# EAGLE design rca_studio_II_single_v3 (EAGLE 8.3.2)
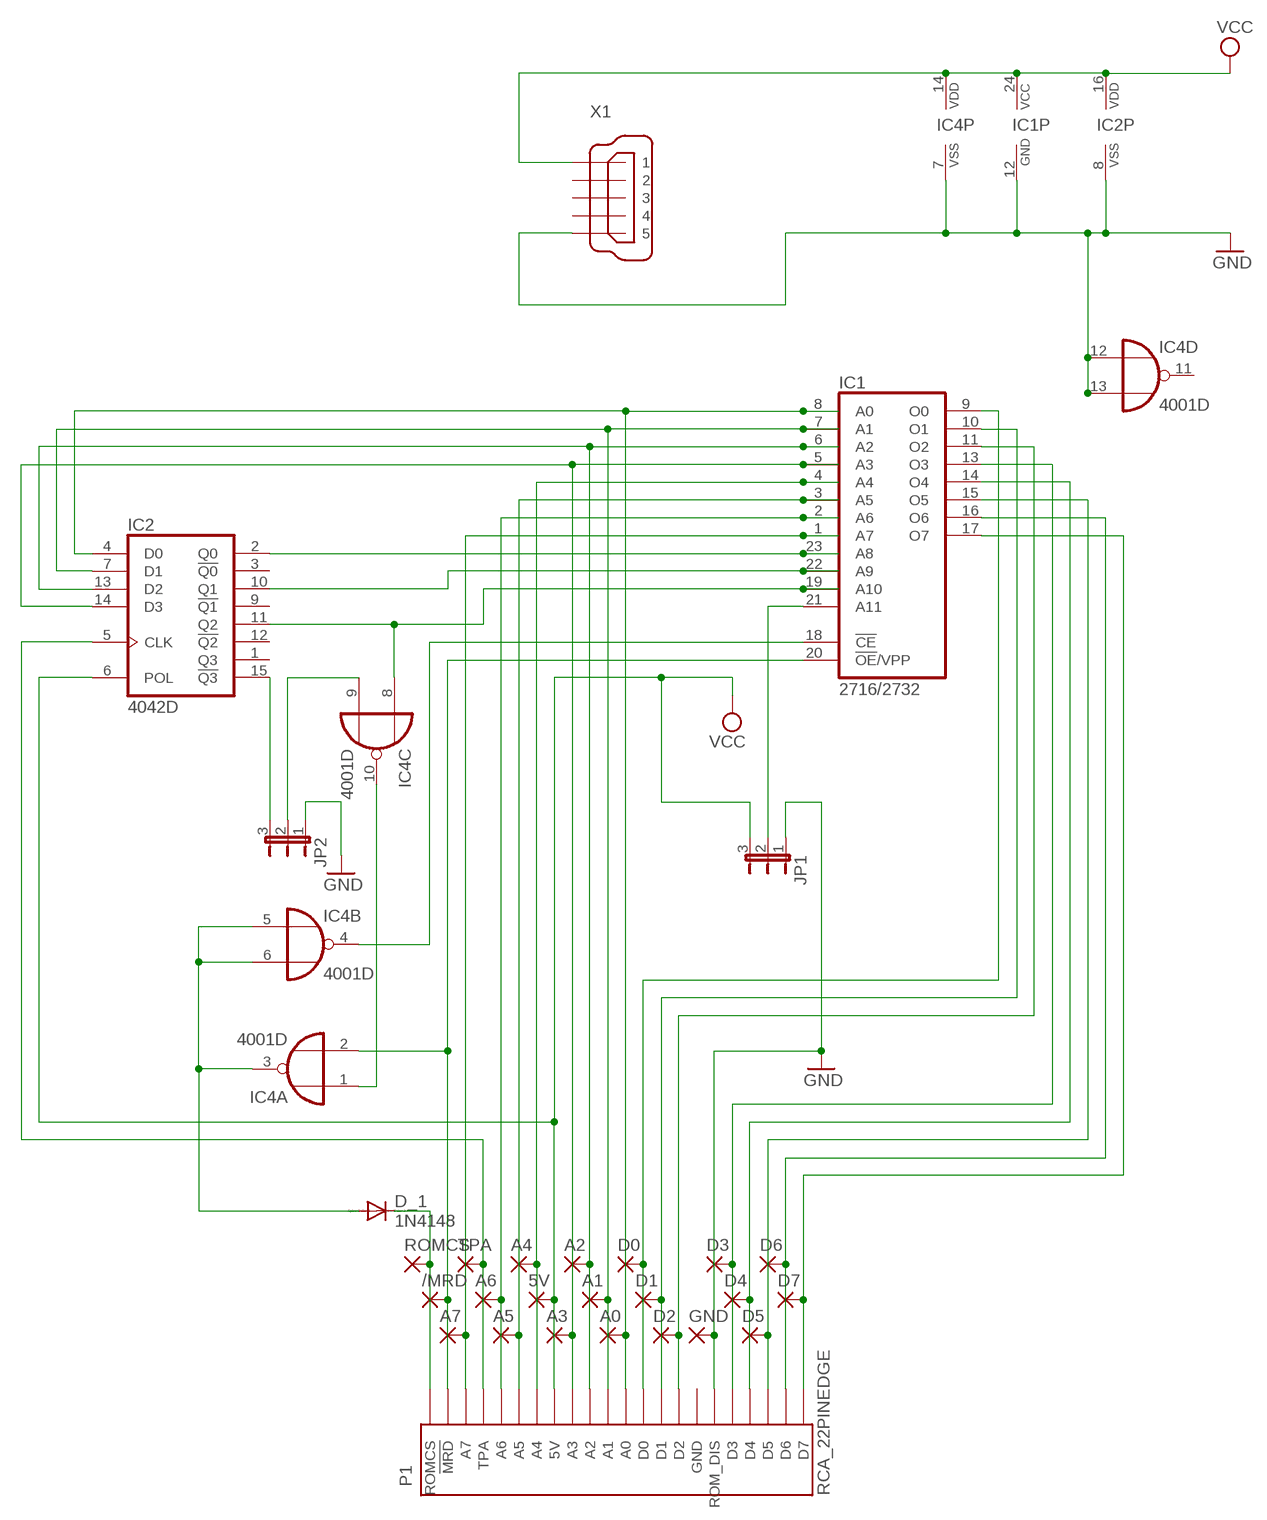
[diagram p0: schematic, sheet 1]

## Parts
5V  WIREPAD2,15/1,0  [2,15/1,0]
/MRD  WIREPAD2,15/1,0  [2,15/1,0]
A0  WIREPAD2,15/1,0  [2,15/1,0]
A1  WIREPAD2,15/1,0  [2,15/1,0]
A2  WIREPAD2,15/1,0  [2,15/1,0]
A3  WIREPAD2,15/1,0  [2,15/1,0]
A4  WIREPAD2,15/1,0  [2,15/1,0]
A5  WIREPAD2,15/1,0  [2,15/1,0]
A6  WIREPAD2,15/1,0  [2,15/1,0]
A7  WIREPAD2,15/1,0  [2,15/1,0]
D0  WIREPAD2,15/1,0  [2,15/1,0]
D1  WIREPAD2,15/1,0  [2,15/1,0]
D2  WIREPAD2,15/1,0  [2,15/1,0]
D3  WIREPAD2,15/1,0  [2,15/1,0]
D4  WIREPAD2,15/1,0  [2,15/1,0]
D5  WIREPAD2,15/1,0  [2,15/1,0]
D6  WIREPAD2,15/1,0  [2,15/1,0]
D7  WIREPAD2,15/1,0  [2,15/1,0]
D_1  1N4148  1N4148DO35-7  [DO35-7]
GND  WIREPAD2,15/1,0  [2,15/1,0]
IC1  2716/2732  2732  [DIL24]
IC2  4042D  [SO16]
IC4  4001D  [SO14]
JP1  JP2E  [JP2]
JP2  JP2E  [JP2]
P1  RCA_22PINEDGE  [RCA_22PINEDGE]
ROMCS  WIREPAD2,15/1,0  [2,15/1,0]
TPA  WIREPAD2,15/1,0  [2,15/1,0]
X1  MINI-USB-32005-301  [32005-301]

## Nets
01: D1.1(P) IC1.10(O1) P1.9(D1)
/MRD: /MRD.1(P) IC1.20(!OE!/VPP) IC4.2(A:I1) P1.21(!MRD)
A0: A0.1(P) IC1.8(A0) IC2.4(D0) P1.11(A0)
A1: A1.1(P) IC1.7(A1) IC2.7(D1) P1.12(A1)
A2: A2.1(P) IC1.6(A2) IC2.13(D2) P1.13(A2)
A3: A3.1(P) IC1.5(A3) IC2.14(D3) P1.14(A3)
A4: A4.1(P) IC1.4(A4) P1.16(A4)
A5: A5.1(P) IC1.3(A5) P1.17(A5)
A6: A6.1(P) IC1.2(A6) P1.18(A6)
A7: A7.1(P) IC1.1(A7) P1.20(A7)
A8: IC1.23(A8) IC2.2(Q0)
A9: IC1.22(A9) IC2.10(Q1)
A10: IC1.19(A10) IC2.11(Q2) IC4.8(C:I0)
A11: IC1.21(A11) JP1.2
D0: D0.1(P) IC1.9(O0) P1.10(D0)
D2: D2.1(P) IC1.11(O2) P1.8(D2)
D3: D3.1(P) IC1.13(O3) P1.5(D3)
D4: D4.1(P) IC1.14(O4) P1.4(D4)
D5: D5.1(P) IC1.15(O5) P1.3(D5)
D6: D6.1(P) IC1.16(O6) P1.2(D6)
D7: D7.1(P) IC1.17(O7) P1.1(D7)
GND: GND.1(P) IC1.12(GND) IC2.8(VSS) IC4.7(P:VSS) IC4.12(D:I0) IC4.13(D:I1) JP1.1 JP2.1 P1.6(ROM_DIS) X1.5
N$1: IC4.1(A:I0) IC4.10(C:O)
N$2: IC4.9(C:I1) JP2.2
N$3: IC1.18(!CE) IC4.4(B:O)
N$21: D_1.A IC4.3(A:O) IC4.5(B:I0) IC4.6(B:I1)
N$23: IC2.15(!Q3) JP2.3
ROMCS: D_1.C P1.22(ROMCS) ROMCS.1(P)
TPA: IC2.5(CLK) P1.19(TPA) TPA.1(P)
VCC: 5V.1(P) IC1.24(VCC) IC2.6(POL) IC2.16(VDD) IC4.14(P:VDD) JP1.3 P1.15(5V) X1.1
Unconnected: IC2.1(Q3) IC2.3(!Q0) IC2.9(!Q1) IC2.12(!Q2) IC4.11(D:O) P1.7(GND) X1.2 X1.3 X1.4

## Library data of the parts
5V /MRD A0 A1-A7 D0 D1-D7 GND ROMCS TPA = wirepad:WIREPAD: Wire PAD connect wire on PCB
D_1 = diode:1N4148: DIODE high speed (Philips)
IC1 = memory:2732: MEMORY
IC2 = 40xx:4042: Quad clocked D LATCH
IC4 = 40xx:4001: Quad 2-input NOR
JP1 JP2 = jumper:JP2E: JUMPER
P1 = mylib:RCA_22PINEDGE: 22 PIN EDGE CONNECTOR FOR PCB
X1 = con-cypressindustries:MINI-USB-: MINI USB-B Conector Source: www.cypressindustries.com; OC_FARNELL: unknown; OC_NEWARK: unknown

## Board
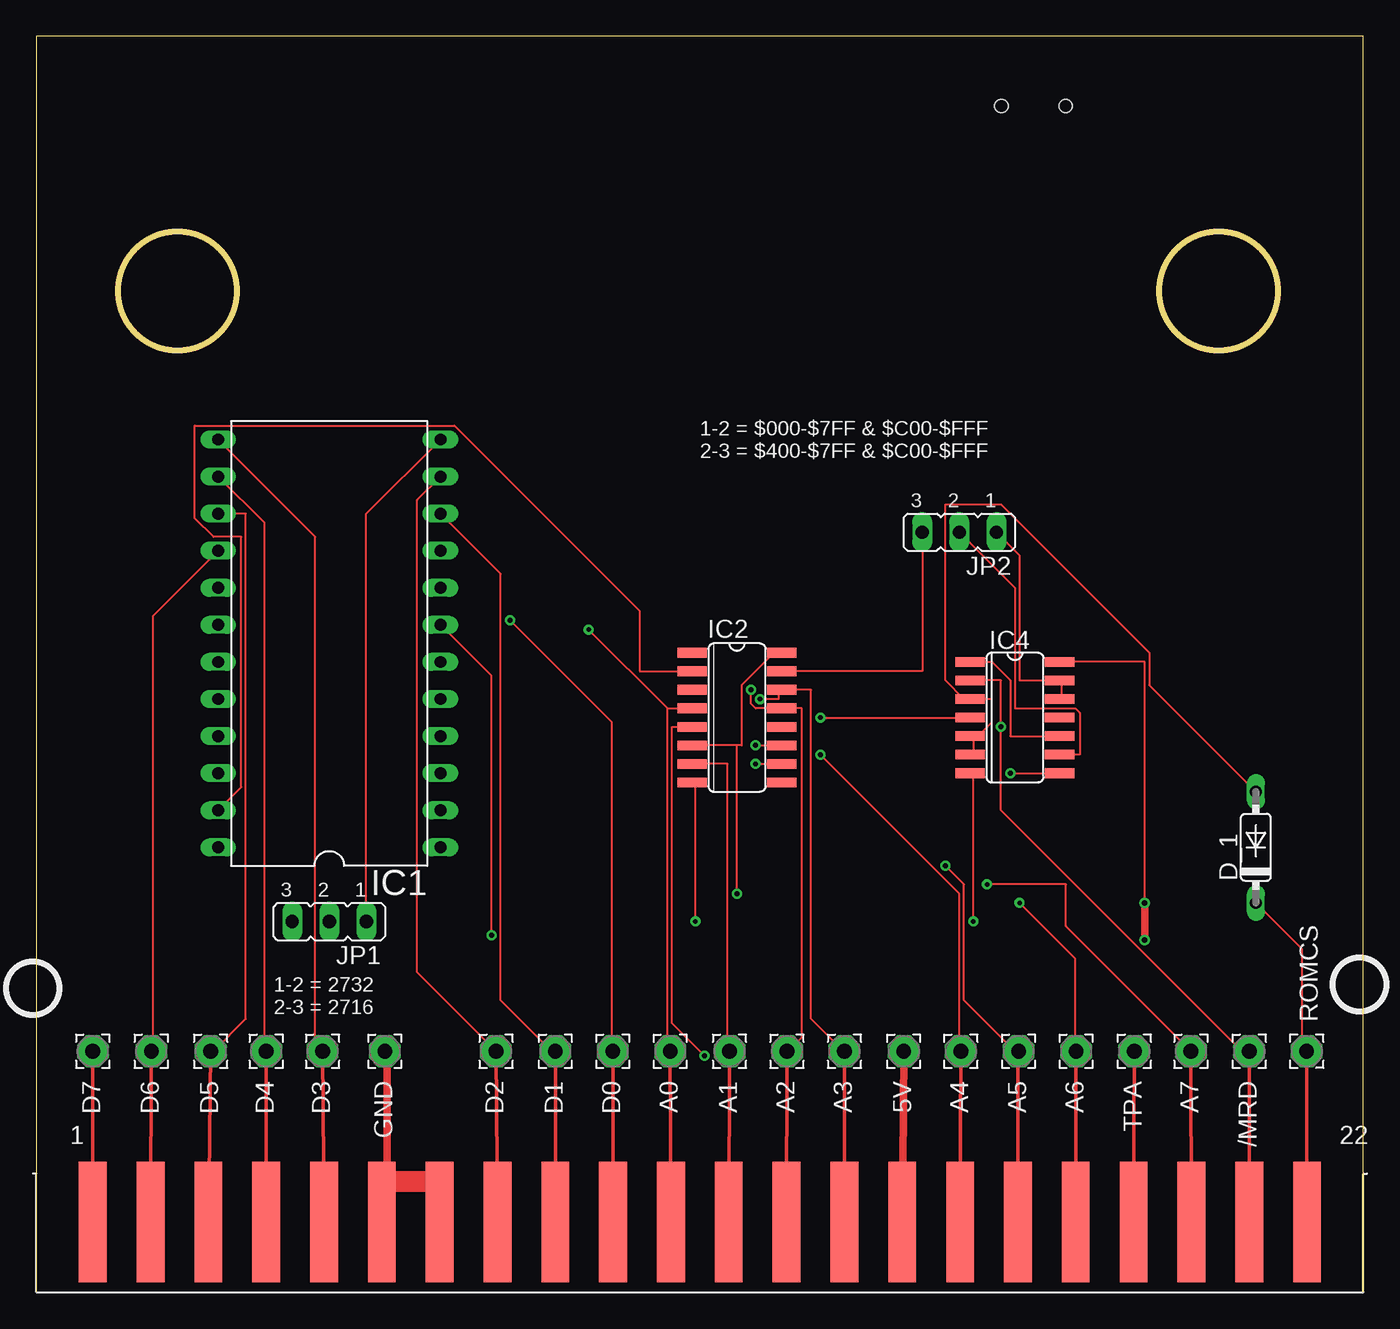
[diagram p1: board, top side]
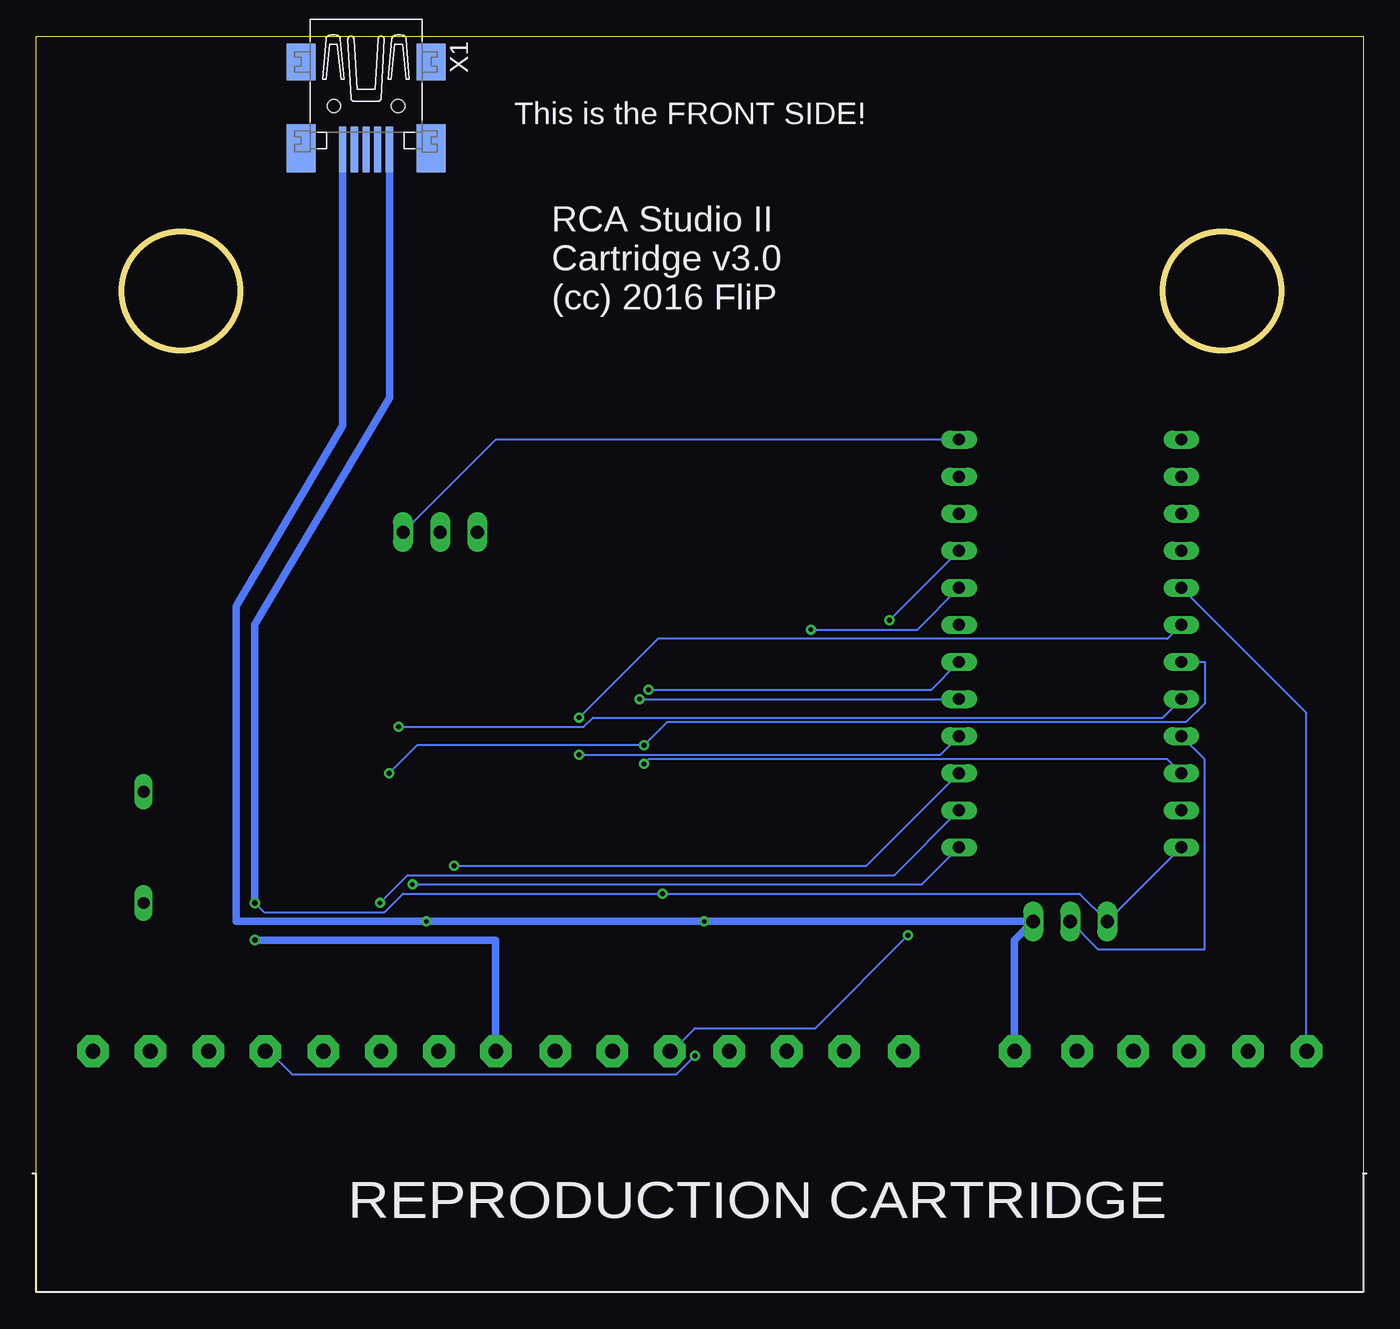
[diagram p2: board, bottom side, seen from below]

Size 90.91 x 86.03 mm. Coordinates in mm from the lower left corner, seen from the top.
Outline: 90.91,0 90.91,86.03 0,86.03 0,0
Outline: circle at 81.03,68.58 radius 4.06
Outline: circle at 9.65,68.58 radius 4.06
Copper layers (1*16): Top 0.0356mm / dielectric 1.5011mm / Bottom 0.0356mm
Design rules "oshpark-2layer": minimum track width 6mil, minimum drill 13mil, track to track 6mil, track to pad 6mil, pad to pad 6mil, via to via 6mil, smd to smd 6mil, copper to edge 15mil, drill to drill 6mil, minimum pad ring 7mil, minimum via ring 7mil, stop-mask expansion 2.5mil, vias tented up to drill 0mil, thermal gap 10mil

### Footprints (pad centres in the part's own frame; a part is rotated, then mirrored left to right if it is on the bottom)
2,15/1,0 = drill 1.016 pad 2.159 octagon: 1 0,0
DO35-7 = drill 0.813 long: A 3.81,0; C -3.81,0
DIL24 = drill 0.813 long: 1 -13.97,-7.62; 2 -11.43,-7.62; 3 -8.89,-7.62; 4 -6.35,-7.62; 5 -3.81,-7.62; 6 -1.27,-7.62; 7 1.27,-7.62; 8 3.81,-7.62; 9 6.35,-7.62; 10 8.89,-7.62; 11 11.43,-7.62; 12 13.97,-7.62; 13 13.97,7.62; 14 11.43,7.62; 15 8.89,7.62; 16 6.35,7.62; 17 3.81,7.62; 18 1.27,7.62; 19 -1.27,7.62; 20 -3.81,7.62; 21 -6.35,7.62; 22 -8.89,7.62; 23 -11.43,7.62; 24 -13.97,7.62
SO16 = smd 0.66 x 2.032: 1 -4.445,-3.073; 2 -3.175,-3.073; 3 -1.905,-3.073; 4 -0.635,-3.073; 5 0.635,-3.073; 6 1.905,-3.073; 7 3.175,-3.073; 8 4.445,-3.073; 9 4.445,3.073; 10 3.175,3.073; 11 1.905,3.073; 12 0.635,3.073; 13 -0.635,3.073; 14 -1.905,3.073; 15 -3.175,3.073; 16 -4.445,3.073
SO14 = smd 0.66 x 2.032: 1 -3.81,-3.073; 2 -2.54,-3.073; 3 -1.27,-3.073; 4 0,-3.073; 5 1.27,-3.073; 6 2.54,-3.073; 7 3.81,-3.073; 8 3.81,3.073; 9 2.54,3.073; 10 1.27,3.073; 11 0,3.073; 12 -1.27,3.073; 13 -2.54,3.073; 14 -3.81,3.073
JP2 = drill 0.914 long: 1 -2.54,0; 2 0,0; 3 2.54,0
RCA_22PINEDGE = smd 1.905 x 8.255: 1 -41.605,4.826; 2 -37.643,4.826; 3 -33.68,4.826; 4 -29.718,4.826; 5 -25.756,4.826; 6 -21.793,4.826; 7 -17.831,4.826; 8 -13.868,4.826; 9 -9.906,4.826; 10 -5.944,4.826; 11 -1.981,4.826; 12 1.981,4.826; 13 5.944,4.826; 14 9.906,4.826; 15 13.868,4.826; 16 17.831,4.826; 17 21.793,4.826; 18 25.756,4.826; 19 29.718,4.826; 20 33.68,4.826; 21 37.643,4.826; 22 41.605,4.826
32005-301 = smd 3.1 x 0.5: 1 3,1.6; 2 3,0.8; 3 3,0; 4 3,-0.8; 5 3,-1.6 | smd 2.5 x 2: M1 -3,-4.45; M2 -3,4.45 | smd 3.3 x 2: M3 2.9,4.45; M4 2.9,-4.45 | hole 0.9: 0,2.2; 0,-2.2

### Placement (x,y rotation side)
5V  59.44,16.51 180 top
/MRD  83.11,16.51 180 top
A0  43.43,16.51 180 top
A1  47.5,16.51 180 top
A2  51.44,16.51 180 top
A3  55.37,16.51 180 top
A4  63.35,16.51 180 top
A5  67.31,16.51 180 top
A6  71.25,16.51 180 top
A7  79.12,16.51 180 top
D0  39.5,16.51 180 top
D1  35.56,16.51 180 top
D2  31.5,16.51 180 top
D3  19.61,16.51 180 top
D4  15.75,16.51 180 top
D5  11.94,16.51 180 top
D6  7.87,16.51 180 top
D7  3.86,16.51 180 top
D_1  83.57,30.48 90 top
GND  23.88,16.51 180 top
IC1  20.07,44.45 90 top
IC2  48.01,39.37 270 top
IC4  67.06,39.37 270 top
JP1  20.07,25.4 180 top
JP2  63.25,52.07 180 top
P1  45.47,0 0 top
ROMCS  87.05,16.51 0 top
TPA  75.23,16.51 180 top
X1  68.33,81.28 270 bottom

### Tracks (layer width: path | path; a pad name or v marks a point on that pad's centre or on a via)
01
  Top 0.152: IC1.10 31.81,49.21 31.81,20 35.31,16.51 D1.1
  Top 0.254: P1.9 D1.1
/MRD  (via drill 0.33)
  Top 0.152: IC4.2 66.1,41.91 v66.1,38.73 66.1,33.02 82.61,16.51 /MRD.1
  Top 0.254: P1.21 /MRD.1
  Bottom 0.152: IC1.20 13.72,39.37 52.77,39.37 53.4,38.73 v66.1,38.73
A0  (via drill 0.33)
  Top 0.152: 43.24,40.01 IC2.4 | 43.24,40.01 43.24,16.51 A0.1 | 43.24,40.01 v37.85,45.4
  Top 0.254: P1.11 A0.1
  Bottom 0.152: IC1.8 30.54,45.4 v37.85,45.4
A1  (via drill 0.33)
  Top 0.152: IC2.7 47.37,36.2 47.37,16.51 A1.1 | IC1.7 31.18,42.23 v31.18,24.45
  Top 0.254: P1.12 A1.1
  Bottom 0.152: v31.18,24.45 37.53,18.1 45.78,18.1 47.37,16.51 A1.1
A2  (via drill 0.33)
  Top 0.152: A2.1 51.5,16.51 52.45,17.46 52.45,40.01 IC2.13 49.28,40.01 48.96,40.32 v48.96,41.27
  Top 0.254: P1.13 A2.1
  Bottom 0.152: IC1.6 29.59,41.27 v48.96,41.27
A3  (via drill 0.33)
  Top 0.152: A3.1 55.31,16.51 53.09,18.73 53.09,41.27 IC2.14 50.86,41.27 50.86,40.64 v49.59,40.64
  Top 0.254: P1.14 A3.1
  Bottom 0.152: v49.59,40.64 IC1.5
A4  (via drill 0.33)
  Top 0.152: v53.72,36.83 63.25,27.3 63.25,16.51 A4.1
  Top 0.254: P1.16 A4.1
  Bottom 0.152: IC1.4 28.96,36.83 v53.72,36.83
A5  (via drill 0.33)
  Top 0.152: v62.29,29.21 63.56,27.94 63.56,20 67.06,16.51 A5.1
  Top 0.254: P1.17 67.26,16.46
  Top 0.508: 67.26,16.46 A5.1
  Bottom 0.152: IC1.3 34.04,29.21 v62.29,29.21
A6  (via drill 0.33)
  Top 0.152: v67.37,26.67 71.18,22.86 71.18,16.51 A6.1
  Top 0.254: P1.18 A6.1
  Bottom 0.152: IC1.2 32.13,28.57 65.47,28.57 v67.37,26.67
A7  (via drill 0.33)
  Top 0.152: v65.15,27.94 70.55,27.94 70.55,25.08 A7.1
  Top 0.254: P1.20 A7.1
  Bottom 0.152: IC1.1 30.23,27.94 v65.15,27.94
A8
  Top 0.152: IC2.2 41.34,42.55 41.34,46.67 28.64,59.37 10.86,59.37 10.86,53.02 12.13,51.75 14.03,51.75 14.03,34.61 IC1.23
A9  (via drill 0.33)
  Top 0.152: v49.28,36.2 IC2.10
  Bottom 0.152: v49.28,36.2 48.96,36.51 13.4,36.51 IC1.22
A10  (via drill 0.33)
  Top 0.152: v49.28,37.47 IC2.11 | v66.74,35.56 IC4.8
  Bottom 0.152: IC1.19 10.86,43.18 10.86,40.32 12.13,39.05 47.69,39.05 v49.28,37.47 64.83,37.47 v66.74,35.56
A11
  Bottom 0.152: IC1.21 10.86,36.51 10.86,23.5 18.16,23.5 JP1.2
D0  (via drill 0.33)
  Top 0.152: v32.45,46.04 39.43,39.05 39.43,16.51 D0.1
  Top 0.254: P1.10 D0.1
  Bottom 0.152: v32.45,46.04 IC1.9
D2
  Top 0.152: IC1.11 26.1,54.29 26.1,21.91 D2.1
  Top 0.254: P1.8 D2.1
D3
  Top 0.152: IC1.13 19.11,51.75 19.11,16.83 19.43,16.51 D3.1
  Top 0.254: P1.5 D3.1
D4
  Top 0.152: IC1.14 15.62,52.7 15.62,16.51 D4.1
  Top 0.254: P1.4 D4.1
D5
  Top 0.152: IC1.15 14.35,53.34 14.35,18.73 12.13,16.51 D5.1
  Top 0.254: P1.3 D5.1
D6
  Top 0.152: IC1.16 8,46.35 8,16.51 D6.1
  Top 0.254: P1.2 D6.1
D7
  Top 0.254: P1.1 D7.1
  Bottom 0.152: IC1.17 3.87,39.69 3.87,16.51 D7.1
GND  (via drill 0.33)
  Top 0.152: IC4.12 70.23,40.64 70.23,41.91 IC4.13 67.37,41.91 67.37,50.48 JP2.1 | v45.15,25.4 45.15,34.92 IC2.8 | v64.2,25.4 64.2,35.56 IC4.7 | IC1.12 22.61,53.34 JP1.1
  Top 0.508: P1.6 23.67,6.24 24.03,7.16 24.03,15.39 GND.1
  Bottom 0.152: JP2.1 59.44,58.42 IC1.12
  Bottom 0.508: X1.5 69.93,59.36 77.22,46.99 77.22,25.4 v64.2,25.4 v45.15,25.4 JP1.1 23.88,24.13 GND.1
N$1
  Top 0.152: IC4.10 66.74,38.1 66.74,41.91 65.47,43.18 IC4.1
N$2
  Top 0.152: IC4.9 71.5,36.83 71.5,39.69 71.18,40.01 67.06,40.01 67.06,48.26 JP2.2
N$3  (via drill 0.33)
  Top 0.152: v53.72,39.37 IC4.4
  Bottom 0.152: v53.72,39.37 48.32,44.77 13.4,44.77 IC1.18
N$21
  Top 0.152: 64.2,37.78 64.2,38.1 IC4.5 64.2,37.78 | 64.2,37.78 64.2,36.83 IC4.6 | 64.2,37.78 65.47,39.05 65.47,40.64 IC4.3 63.56,40.64 62.29,41.91 62.29,53.98 66.1,53.98 76.26,43.81 76.26,41.59 D_1.A
N$23
  Top 0.152: IC2.15 60.71,42.55 JP2.3
N$37
  Top 1.422: 23.88,7.62 27.69,7.62
ROMCS
  Top 0.152: D_1.C 86.74,23.5 86.74,16.51 ROMCS.1
  Top 0.254: P1.22 ROMCS.1
TPA  (via drill 0.33)
  Top 0.152: IC2.5 43.56,38.73 43.56,18.41 v45.78,16.19
  Top 0.254: P1.19 TPA.1
  Bottom 0.152: v45.78,16.19 47.05,14.92 73.41,14.92 74.99,16.51 TPA.1
VCC  (via drill 0.33, 0.35)
  Top 0.152: 48.01,37.47 48.32,37.47 48.32,41.59 50.55,43.81 IC2.16 | 48.01,37.47 IC2.6 | IC4.14 75.95,43.18 v75.95,26.67 | v48.01,27.3 48.01,37.47
  Top 0.508: v75.95,24.13 v75.95,26.67 | P1.15 5V.1
  Bottom 0.152: IC1.24 JP1.3 19.43,27.3 v48.01,27.3 65.79,27.3 67.06,26.04 75.31,26.04 v75.95,26.67
  Bottom 0.508: X1.1 66.73,61.29 75.95,45.72 v75.95,26.67 | v75.95,24.13 59.44,24.13 5V.1

### Text on the board
tNames: 1-2 = $000-$7FF & $C00-$FFF / 2-3 = $400-$7FF & $C00-$FFF | 1-2 = 2732 / 2-3 = 2716
bNames: This is the FRONT SIDE! | RCA Studio II / Cartridge v3.0 / (cc) 2016 FliP | REPRODUCTION CARTRIDGE